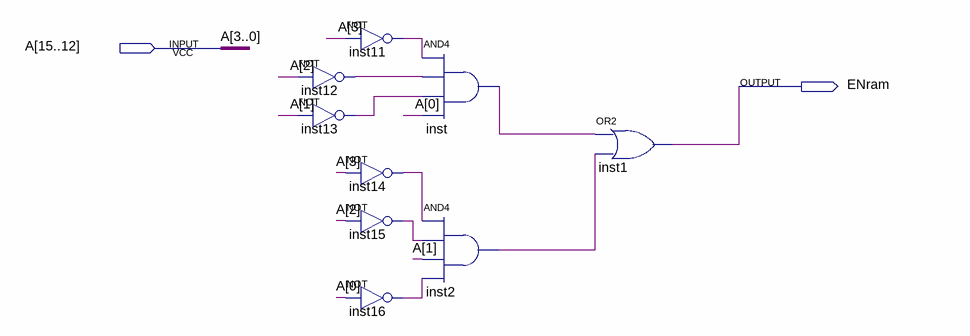
[diagram p0: schematic sheet]
// Quartus schematic CSram.bdf as structural Verilog: 9 symbols, 2 pins
module CSram (
  input  [15:12] A,
  output ENram
);

  wire inst2_out, inst11_out, inst12_out, inst13_out, inst14_out, inst15_out, inst16_out, inst_out;

  not inst12 (inst12_out, A[14]);
  not inst13 (inst13_out, A[13]);
  not inst11 (inst11_out, A[15]);
  not inst14 (inst14_out, A[15]);
  not inst15 (inst15_out, A[14]);
  not inst16 (inst16_out, A[12]);
  and inst (inst_out, inst11_out, inst12_out, inst13_out, A[12]);
  and inst2 (inst2_out, inst14_out, inst15_out, A[13], inst16_out);
  or inst1 (ENram, inst_out, inst2_out);

  // Other names for the same wires on the sheet: A[3:0] = A
endmodule
